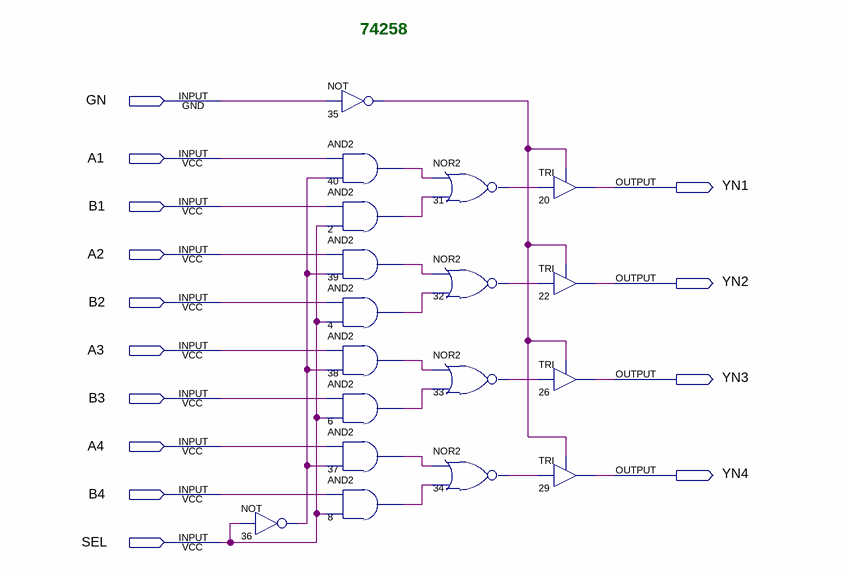
[diagram p0: schematic sheet]
// Quartus schematic 74258.bdf as structural Verilog: 18 symbols, 14 pins
module \74258  (
  input  GN,
  input  A1,
  input  B1,
  input  A2,
  input  B2,
  input  A3,
  input  B3,
  input  A4,
  input  B4,
  input  SEL,
  output YN1,
  output YN2,
  output YN3,
  output YN4
);

  wire n2_out, n4_out, n6_out, n8_out, n31_out, n32_out, n33_out, n34_out, n35_out, n36_out, n37_out,
       n38_out, n39_out, n40_out;

  not u_36 (n36_out, SEL);
  not u_35 (n35_out, GN);
  and u_40 (n40_out, A1, n36_out);
  and u_2 (n2_out, B1, SEL);
  and u_39 (n39_out, A2, n36_out);
  and u_4 (n4_out, B2, SEL);
  and u_38 (n38_out, A3, n36_out);
  and u_6 (n6_out, B3, SEL);
  and u_37 (n37_out, A4, n36_out);
  and u_8 (n8_out, B4, SEL);
  nor u_31 (n31_out, n40_out, n2_out);
  nor u_32 (n32_out, n39_out, n4_out);
  nor u_33 (n33_out, n38_out, n6_out);
  nor u_34 (n34_out, n37_out, n8_out);
  TRI u_20 (.IN(n31_out), .OE(n35_out), .OUT(YN1));
  TRI u_22 (.IN(n32_out), .OE(n35_out), .OUT(YN2));
  TRI u_26 (.IN(n33_out), .OE(n35_out), .OUT(YN3));
  TRI u_29 (.IN(n34_out), .OE(n35_out), .OUT(YN4));

  // Notes on the sheet:
  //   74258
endmodule
